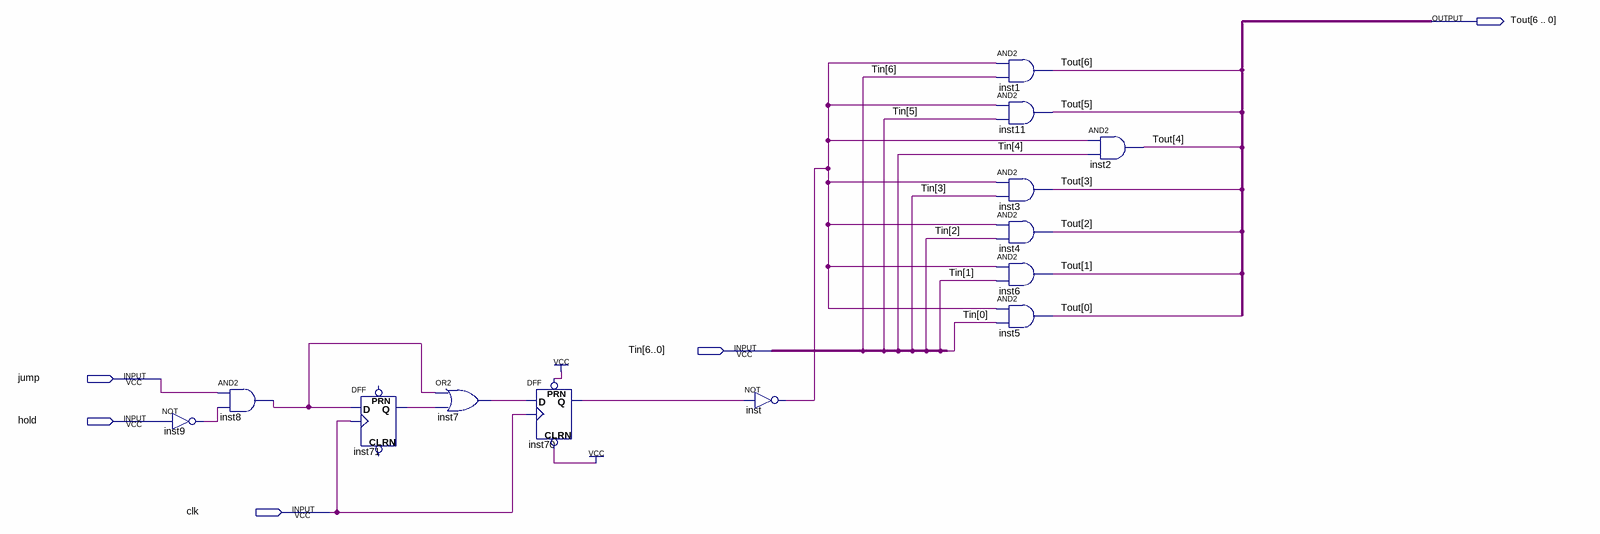
[diagram p0: schematic sheet]
// Quartus schematic T_jump.bdf as structural Verilog: 13 symbols, 5 pins
module T_jump (
  input  [6:0] Tin,
  input  jump,
  input  hold,
  input  clk,
  output [6:0] Tout
);

  wire inst7_out, inst8_out, inst9_out, inst70_q, inst71_q, inst_out;

  not inst9 (inst9_out, hold);
  and inst8 (inst8_out, jump, inst9_out);
  DFF inst71 (.CLK(clk), .D(inst8_out), .Q(inst71_q));  // open: CLRN, PRN
  or inst7 (inst7_out, inst8_out, inst71_q);
  DFF inst70 (.CLRN(1'b1), .CLK(clk), .D(inst7_out), .PRN(1'b1), .Q(inst70_q));
  not inst (inst_out, inst70_q);
  and inst1 (Tout[6], inst_out, Tin[6]);
  and inst11 (Tout[5], inst_out, Tin[5]);
  and inst3 (Tout[3], inst_out, Tin[3]);
  and inst4 (Tout[2], inst_out, Tin[2]);
  and inst6 (Tout[1], inst_out, Tin[1]);
  and inst5 (Tout[0], inst_out, Tin[0]);
  and inst2 (Tout[4], inst_out, Tin[4]);
endmodule
